# Altium schematic sheet Sheet2.SchDoc: Наименование
size 420 x 297 mm; ApprovedBy: Vasil; CheckedBy: Vasil; Author: Vasil; CompanyName: Vasil; DrawnBy: n.a.; Engineer: Vasil; SheetNumber: 2; SheetTotal: 5; PageSetup: Record=PageOptions|CenterHorizontal=True|CenterVertical=True|PrintScale=0.94|XCorrection=1.00|YCorrection=1.00|PrintKind=1|BorderSize=5000000|LeftOffset=0|BottomOffset=0|Orientation=1|PaperLength=1000|PaperWidth=1000|Scale=100|PaperSource=7|PrintQuality=-4|MediaType=1|DitherType=10|PaperKind=A4|PrintScaleMode=1; DecimalNumber: 000.00006.001.VG; HeadOfSector: n.a.; MainDevice: HW; Name: CNC_interfaces_board; DocumentName: Sheet1.SCHDOC
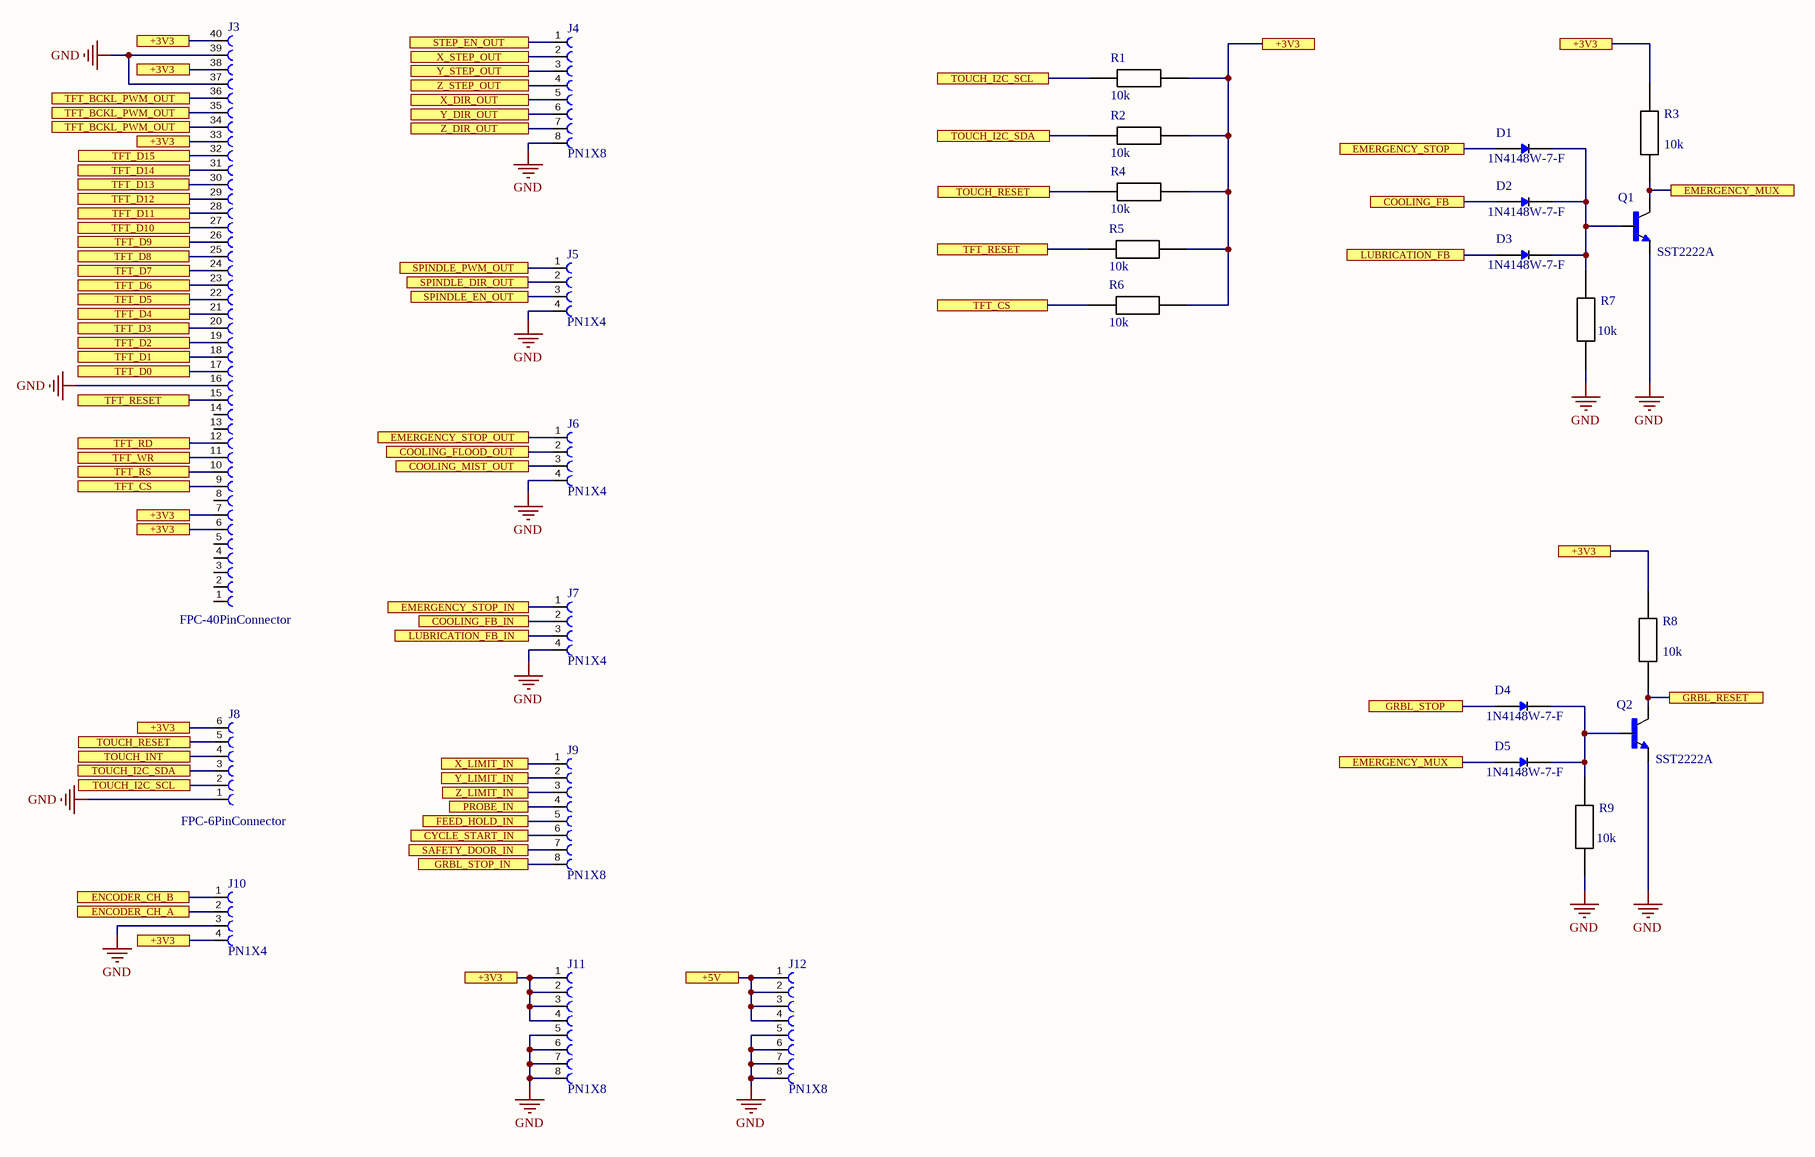
[diagram p0: Sheet2.SchDoc]

## Parts
D1  1N4148W-7-F  [SOD123]
D2  1N4148W-7-F  [SOD123]
D3  1N4148W-7-F  [SOD123]
D4  1N4148W-7-F  [SOD123]
D5  1N4148W-7-F  [SOD123]
J3  FPC-40PinConnector  [687140149022]
J4  PN1X8  [PN1X8]
J5  PN1X4  [PN1X4]
J6  PN1X4  [PN1X4]
J7  PN1X4  [PN1X4]
J8  FPC-6PinConnector  [687106149022]
J9  PN1X8  [PN1X8]
J10  PN1X4  [PN1X4]
J11  PN1X8  [PN1X8]
J12  PN1X8  [PN1X8]
Q1  SST2222A  [SOT-23-3]
Q2  SST2222A  [SOT-23-3]
R1  10k  [SMD 0805]
R2  10k  [SMD 0805]
R3  10k  [SMD 0805]
R4  10k  [SMD 0805]
R5  10k  [SMD 0805]
R6  10k  [SMD 0805]
R7  10k  [SMD 0805]
R8  10k  [SMD 0805]
R9  10k  [SMD 0805]

## Ports
+3V3, +5V, COOLING_FB, COOLING_FB_IN, COOLING_FLOOD_OUT, COOLING_MIST_OUT, CYCLE_START_IN, EMERGENCY_MUX, EMERGENCY_STOP, EMERGENCY_STOP_IN, EMERGENCY_STOP_OUT, ENCODER_CH_A, ENCODER_CH_B, FEED_HOLD_IN, GRBL_RESET, GRBL_STOP, GRBL_STOP_IN, LUBRICATION_FB, LUBRICATION_FB_IN, PROBE_IN, SAFETY_DOOR_IN, SPINDLE_DIR_OUT, SPINDLE_EN_OUT, SPINDLE_PWM_OUT, STEP_EN_OUT, TFT_BCKL_PWM_OUT, TFT_CS, TFT_D0, TFT_D1, TFT_D2, TFT_D3, TFT_D4, TFT_D5, TFT_D6, TFT_D7, TFT_D8, TFT_D9, TFT_D10, TFT_D11, TFT_D12, TFT_D13, TFT_D14, TFT_D15, TFT_RD, TFT_RESET, TFT_RS, TFT_WR, TOUCH_I2C_SCL, TOUCH_I2C_SDA, TOUCH_INT, TOUCH_RESET, X_DIR_OUT, X_LIMIT_IN, X_STEP_OUT, Y_DIR_OUT, Y_LIMIT_IN, Y_STEP_OUT, Z_DIR_OUT, Z_LIMIT_IN, Z_STEP_OUT

## Nets
GND: J3.16 J3.37 J3.39 J4.8 J5.4 J6.4 J7.4 J8.1 J10.3 J11.5 J11.6 J11.7 J11.8 J12.5 J12.6 J12.7 J12.8 Q1.2(E) Q2.2(E) R7.2 R9.2
+3V3: J3.6 J3.7 J3.33 J3.38 J3.40 J8.6 J10.4 J11.1 J11.2 J11.3 J11.4 R1.1 R2.2 R3.1 R4.2 R5.1 R6.1 R8.1 ; port +3V3
+5V: J12.1 J12.2 J12.3 J12.4 ; port +5V
COOLING_FB: D2.A ; port COOLING_FB
COOLING_FB_IN: J7.2 ; port COOLING_FB_IN
COOLING_FLOOD_OUT: J6.2 ; port COOLING_FLOOD_OUT
COOLING_MIST_OUT: J6.3 ; port COOLING_MIST_OUT
CYCLE_START_IN: J9.6 ; port CYCLE_START_IN
EMERGENCY_MUX: D5.A Q1.3(C) R3.2 ; port EMERGENCY_MUX
EMERGENCY_STOP: D1.A ; port EMERGENCY_STOP
EMERGENCY_STOP_IN: J7.1 ; port EMERGENCY_STOP_IN
EMERGENCY_STOP_OUT: J6.1 ; port EMERGENCY_STOP_OUT
ENCODER_CH_A: J10.2 ; port ENCODER_CH_A
ENCODER_CH_B: J10.1 ; port ENCODER_CH_B
FEED_HOLD_IN: J9.5 ; port FEED_HOLD_IN
GRBL_RESET: Q2.3(C) R8.2 ; port GRBL_RESET
GRBL_STOP: D4.A ; port GRBL_STOP
GRBL_STOP_IN: J9.8 ; port GRBL_STOP_IN
LUBRICATION_FB: D3.A ; port LUBRICATION_FB
LUBRICATION_FB_IN: J7.3 ; port LUBRICATION_FB_IN
PROBE_IN: J9.4 ; port PROBE_IN
SAFETY_DOOR_IN: J9.7 ; port SAFETY_DOOR_IN
SPINDLE_DIR_OUT: J5.2 ; port SPINDLE_DIR_OUT
SPINDLE_EN_OUT: J5.3 ; port SPINDLE_EN_OUT
SPINDLE_PWM_OUT: J5.1 ; port SPINDLE_PWM_OUT
STEP_EN_OUT: J4.1 ; port STEP_EN_OUT
TFT_BCKL_PWM_OUT: J3.34 J3.35 J3.36 ; port TFT_BCKL_PWM_OUT
TFT_CS: J3.9 R6.2 ; port TFT_CS
TFT_D0: J3.17 ; port TFT_D0
TFT_D1: J3.18 ; port TFT_D1
TFT_D2: J3.19 ; port TFT_D2
TFT_D3: J3.20 ; port TFT_D3
TFT_D4: J3.21 ; port TFT_D4
TFT_D5: J3.22 ; port TFT_D5
TFT_D6: J3.23 ; port TFT_D6
TFT_D7: J3.24 ; port TFT_D7
TFT_D8: J3.25 ; port TFT_D8
TFT_D9: J3.26 ; port TFT_D9
TFT_D10: J3.27 ; port TFT_D10
TFT_D11: J3.28 ; port TFT_D11
TFT_D12: J3.29 ; port TFT_D12
TFT_D13: J3.30 ; port TFT_D13
TFT_D14: J3.31 ; port TFT_D14
TFT_D15: J3.32 ; port TFT_D15
TFT_RD: J3.12 ; port TFT_RD
TFT_RESET: J3.15 R5.2 ; port TFT_RESET
TFT_RS: J3.10 ; port TFT_RS
TFT_WR: J3.11 ; port TFT_WR
TOUCH_I2C_SCL: J8.2 R1.2 ; port TOUCH_I2C_SCL
TOUCH_I2C_SDA: J8.3 R2.1 ; port TOUCH_I2C_SDA
TOUCH_INT: J8.4 ; port TOUCH_INT
TOUCH_RESET: J8.5 R4.1 ; port TOUCH_RESET
X_DIR_OUT: J4.5 ; port X_DIR_OUT
X_LIMIT_IN: J9.1 ; port X_LIMIT_IN
X_STEP_OUT: J4.2 ; port X_STEP_OUT
Y_DIR_OUT: J4.6 ; port Y_DIR_OUT
Y_LIMIT_IN: J9.2 ; port Y_LIMIT_IN
Y_STEP_OUT: J4.3 ; port Y_STEP_OUT
Z_DIR_OUT: J4.7 ; port Z_DIR_OUT
Z_LIMIT_IN: J9.3 ; port Z_LIMIT_IN
Z_STEP_OUT: J4.4 ; port Z_STEP_OUT
NetD1_C: D1.C(K) D2.C(K) D3.C(K) Q1.1(B) R7.1
NetD4_C: D4.C(K) D5.C(K) Q2.1(B) R9.1

Not connected (* = marked no-connect by the designer): J3 1(40) 2(39) 3(38) 4(37) 5(36) 8(33) 13(28) 14(27)

## Notes on the sheet
- Перв.примен.
- Справ.№
- Подп. и дата
- Инв.№ дубл.
- Взам.инв.№
- Подп.и дата
- Разраб.
- Изм.
- Лист
- № докум.
- Подп.
- Дата
- Лит.
- Масштаб
- Масса
- Т.контр.
- Пров.
- СХЕМА   ЭЛЕКТРИЧЕСКАЯ
- ПРИНЦИПИАЛЬНАЯ
- Листов
- Инв.№ подл.
- Утв.
- Н.контр.
- Нач.сект.
- Формат  A3

## Library data of the parts
D1-D5 = 1N4148W-7-F: Diode Standard 100V 300mA _DC_ Surface Mount SOD-123; MF: DIODES / ZETEX; HelpURL: https://store.comet.bg/Catalogue/Product/9613/; Model: 1N4148W-7-F; Case: SOD-123 Diodes Inc.; Value: 1N4148W-7-F
J3 = FPC-40PinConnector: 40 Position FFC, FPC Connector Contacts, Bottom 0.020 (0.50mm) Surface Mount, Right Angle; MF: Wurth Electronics; Value: FPC-40PinConnector; Check_prices: https://www.snapeda.com/parts/687140149022/Wurth+Electronics+Inc./view-part/?ref=eda; MP: 687140149022; Purchase-URL: https://pricing.snapeda.com/search/part/687140149022/?ref=eda; Price: None; Availability: In Stock; Package: None; SnapEDA_Link: https://www.snapeda.com/parts/687140149022/Wurth+Electronics+Inc./view-part/?ref=snap
J4 J9 J11 J12 = PN1X8: Single Row / Straight / Without Shroud Female header Female 8 ¦ WÃ¼rth Elektronik 61300711821 @ Pin header, socket _Si...; MF: WÃ¼rth Elektronik; Value: PN1X8; Price: None; MP: 61300711821; SnapEDA_Link: https://www.snapeda.com/parts/61300711821/W%C3%BCrth%20Elektronik/view-part/2704590/?ref=snap; Package: None; Availability: Unavailable
J5-J7 J10 = PN1X4: Single Row / Straight / Without Shroud Female header Female 4 @ Pin header, socket _Si...; MF: WÃ¼rth Elektronik; MP: 61300711821; Value: PN1X4; Price: None; SnapEDA_Link: https://www.snapeda.com/parts/61300711821/W%C3%BCrth%20Elektronik/view-part/2704590/?ref=snap; Package: None; Availability: Unavailable
J8 = FPC-6PinConnector: 6 Position FFC, FPC Connector Contacts, Bottom 0.020 (0.50mm) Surface Mount, Right Angle; MF: WÃ¼rth Elektronik; MP: 687106149022; Purchase-URL: https://pricing.snapeda.com/search/part/687106149022/?ref=eda; Price: None; SnapEDA_Link: https://www.snapeda.com/parts/687106149022/Wurth+Elektronik/view-part/?ref=snap; Check_prices: https://www.snapeda.com/parts/687106149022/Wurth+Elektronik/view-part/?ref=eda; Package: None; Availability: In Stock; Value: FPC-6PinConnector
Q1 Q2 = SST2222A: Transistor NPN 40V 600mA 300MHz 350mW; Manufacturer: ROHM Semiconductor; Case: SOT-23-3 SST3; HelpURL: https://store.comet.bg/Catalogue/Product/23715/; Value: SST2222A
R1-R9 = Resistor_1: RES; HelpURL: https://store.comet.bg/Catalogue/RES/Resistors/#eyJpcHAiOiIxMDAiLCJtIjoiIn0%3D; Value: 10k